# Altium schematic sheet CAN.SchDoc
size 297 x 210 mm
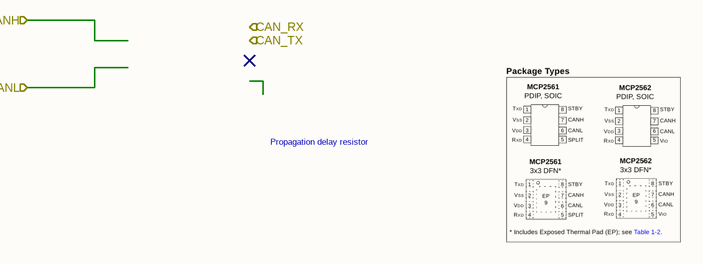
[diagram p0: CAN.SchDoc]

## Ports
CAN_RX (out), CAN_TX (in), CANH (in), CANL (in)

## Notes on the sheet
- Propagation delay
  resistor
- 1
- 2
- 3
- 4
- 5
- 6
- A
- B
- C
- D
- Title: BLDC Driver 4.11
- File: CAN.sch
- Sheet: /
- Benjamin Vedder
- KiCad E.D.A.  kicad (5.1.4)-1
- Size: A4
- Date: 21 aug 2015
- Rev: 4.12
- Id: 4/7